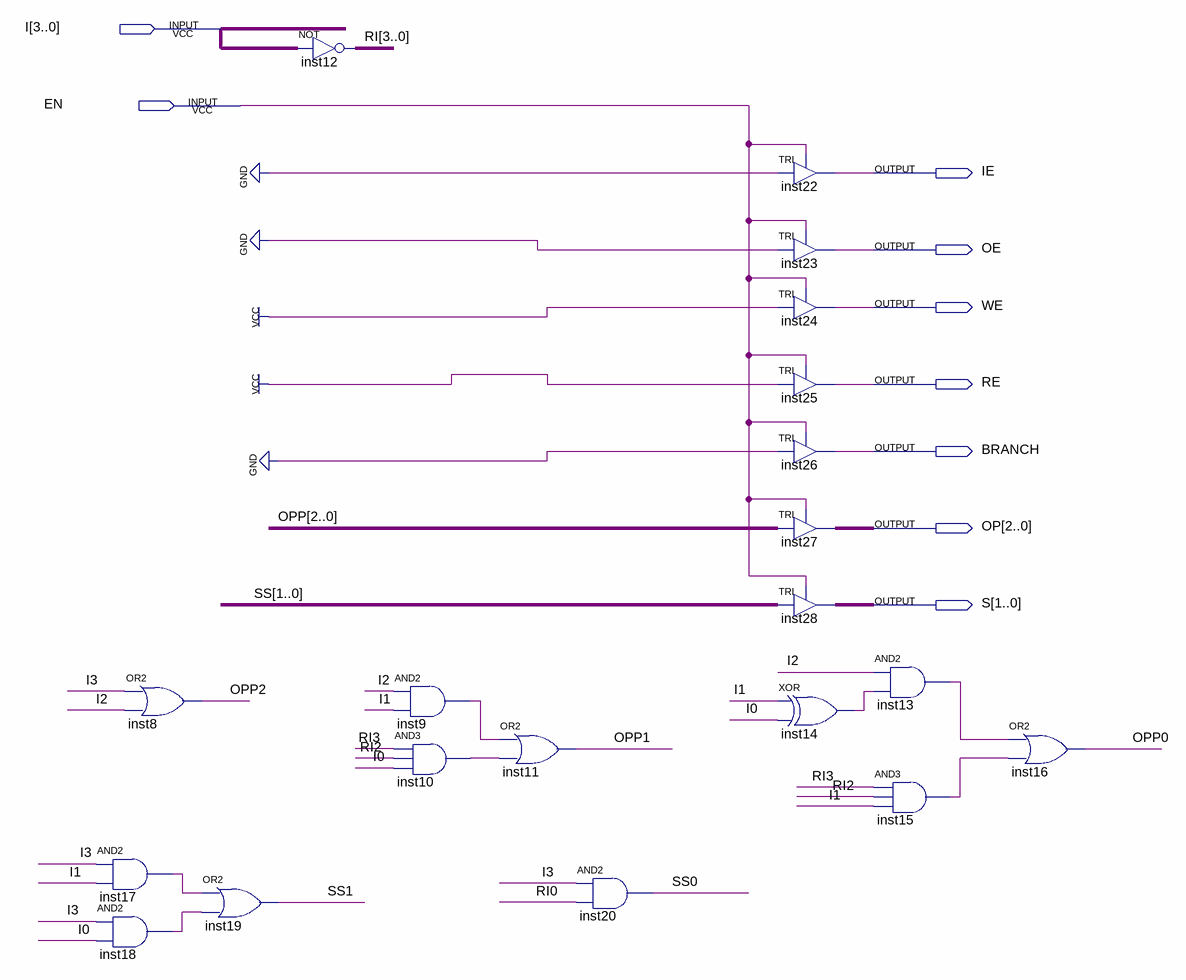
[diagram p0: schematic sheet]
// Quartus schematic LENHCOBAN.bdf as structural Verilog: 20 symbols, 9 pins
module LENHCOBAN (
  input  [3:0] I,
  input  EN,
  output IE,
  output OE,
  output WE,
  output RE,
  output BRANCH,
  output [2:0] OP,
  output [1:0] S
);

  wire inst9_out, inst10_out, inst13_out, inst14_out, inst15_out, inst17_out, inst18_out;
  wire [1:0] SS;
  wire [2:0] OPP;
  wire [3:0] RI;

  or inst8 (OPP[2], I[3], I[2]);
  and inst17 (inst17_out, I[3], I[1]);
  and inst18 (inst18_out, I[3], I[0]);
  or inst19 (SS[1], inst17_out, inst18_out);
  assign RI = ~I;  // NOT inst12, 4 bits wide
  and inst9 (inst9_out, I[2], I[1]);
  and inst10 (inst10_out, RI[3], RI[2], I[0]);
  or inst11 (OPP[1], inst9_out, inst10_out);
  and inst20 (SS[0], I[3], RI[0]);
  TRI inst22 (.IN(1'b0), .OE(EN), .OUT(IE));
  TRI inst23 (.IN(1'b0), .OE(EN), .OUT(OE));
  TRI inst24 (.IN(1'b1), .OE(EN), .OUT(WE));
  TRI inst25 (.IN(1'b1), .OE(EN), .OUT(RE));
  TRI inst26 (.IN(1'b0), .OE(EN), .OUT(BRANCH));
  TRI inst27[2:0] (.IN(OPP), .OE(EN), .OUT(OP));
  TRI inst28[1:0] (.IN(SS), .OE(EN), .OUT(S));
  xor inst14 (inst14_out, I[1], I[0]);
  and inst13 (inst13_out, I[2], inst14_out);
  and inst15 (inst15_out, RI[3], RI[2], I[1]);
  or inst16 (OPP[0], inst13_out, inst15_out);
endmodule
